# EAGLE design H_bridge (EAGLE 6.5.0)
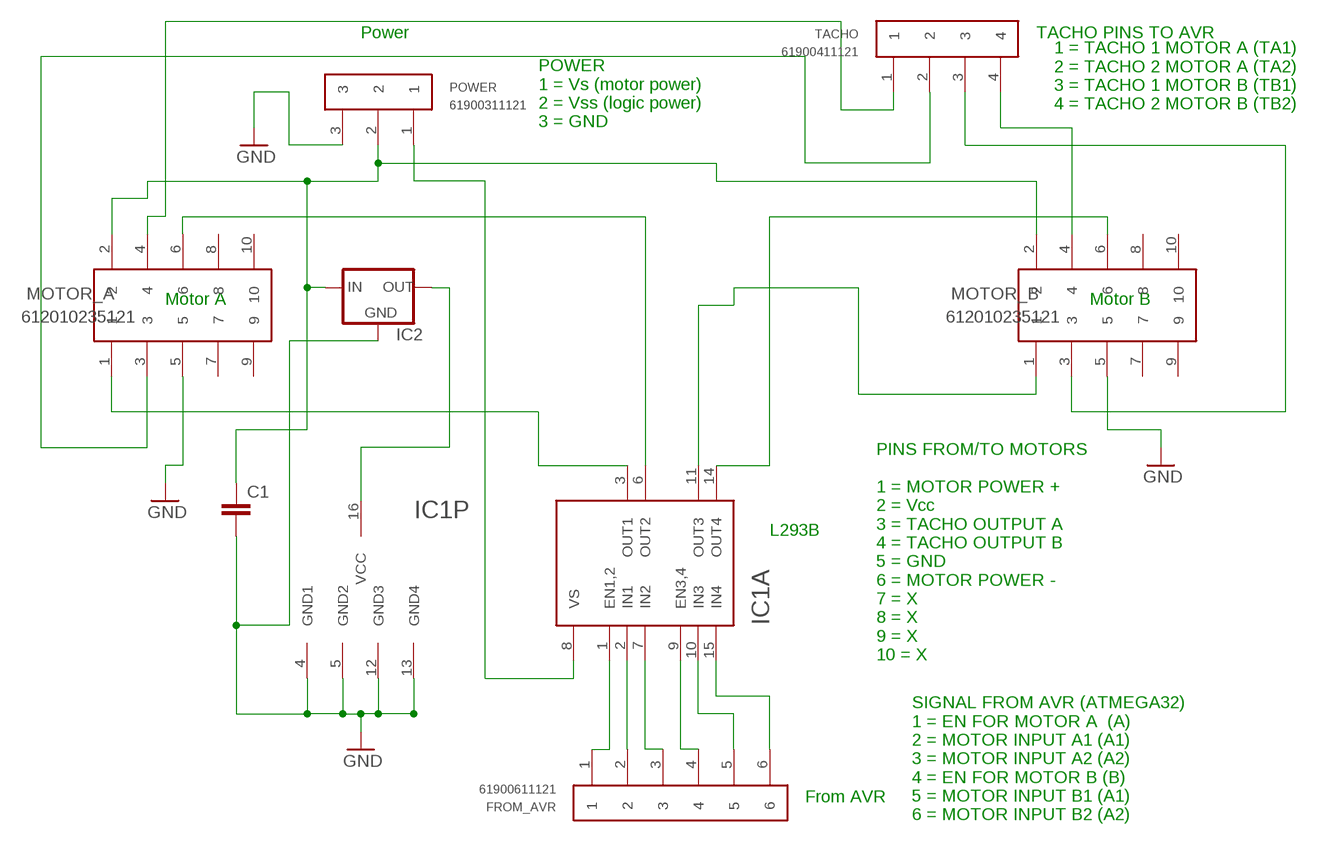
[diagram p0: schematic, sheet 1]

## Parts
C1  C7.5/5  [C7.5B5]
FROM_AVR  61900611121  [61900611121]
IC1  L293D  [DIP16]
IC2  V_REG_78XX-TO-220  [TO-220-ALT]
MOTOR_A  612010235121  [612010235121]
MOTOR_B  612010235121  [612010235121]
POWER  61900311121  [61900311121]
TACHO  61900411121  [61900411121]

## Nets
GND: C1.2 IC1.4(P:GND1) IC1.5(P:GND2) IC1.12(P:GND3) IC1.13(P:GND4) IC2.GND MOTOR_A.5 MOTOR_B.5 POWER.3
N$1: IC1.3(A:OUT1) MOTOR_A.1
N$2: IC1.6(A:OUT2) MOTOR_A.6
N$3: IC1.11(A:OUT3) MOTOR_B.1
N$4: IC1.14(A:OUT4) MOTOR_B.6
N$5: MOTOR_B.3 TACHO.3
N$6: IC1.16(P:VCC) IC2.OUT
N$7: C1.1 IC2.IN MOTOR_A.2 MOTOR_B.2 POWER.2
N$8: FROM_AVR.1 IC1.1(A:EN1,2)
N$9: FROM_AVR.2 IC1.2(A:IN1)
N$10: FROM_AVR.3 IC1.7(A:IN2)
N$11: FROM_AVR.4 IC1.9(A:EN3,4)
N$12: FROM_AVR.5 IC1.10(A:IN3)
N$13: FROM_AVR.6 IC1.15(A:IN4)
N$14: MOTOR_A.4 TACHO.1
N$15: MOTOR_A.3 TACHO.2
N$17: MOTOR_B.4 TACHO.4
N$18: IC1.8(A:VS) POWER.1
Unconnected: MOTOR_A.7 MOTOR_A.8 MOTOR_A.9 MOTOR_A.10 MOTOR_B.7 MOTOR_B.8 MOTOR_B.9 MOTOR_B.10

## Notes on the sheet
- Power | TACHO PINS TO AVR
- 1 = TACHO 1 MOTOR A (TA1)
  2 = TACHO 2 MOTOR A (TA2)
  3 = TACHO 1 MOTOR B (TB1)
  4 = TACHO 2 MOTOR B (TB2)
- POWER
  1 = Vs (motor power)
  2 = Vss (logic power)
  3 = GND
- Motor A | Motor B
- L293B
- PINS FROM/TO MOTORS
  
  1 = MOTOR POWER +
  2 = Vcc
  3 = TACHO OUTPUT A
  4 = TACHO OUTPUT B
  5 = GND
  6 = MOTOR POWER -
  7 = X
  8 = X
  9 = X
  10 = X
- From AVR
- SIGNAL FROM AVR (ATMEGA32)
  1 = EN FOR MOTOR A  (A)
  2 = MOTOR INPUT A1 (A1)
  3 = MOTOR INPUT A2 (A2)
  4 = EN FOR MOTOR B (B)
  5 = MOTOR INPUT B1 (A1)
  6 = MOTOR INPUT B2 (A2)

## Library data of the parts
C1 = capacitor-wima:C: CAPACITOR naming: grid - package width
FROM_AVR = Wuerth_Elektronik_eiCan_09_Wire_to_Board_Connectors:61900611121: WR-WTB 2.54mm Male Locking Header, 6 Pins
IC1 = ads:L293D: L293D Quad Half H-Bridge with integrated diodes
IC2 = SparkFun-PowerIC:V_REG_78XX: Voltage Regulator Standard 7805 5V regulator. IGO (Input Ground Output). Spark Fun Electronics SKU : COM-00107
MOTOR_A MOTOR_B = Wuerth_Elektronik_eiCan_05_Box_Header_IDC_Connectors_1_2:612010235121: WR-BHD 2.54mm Male Box Header High Temperature, 10 Pins
POWER = Wuerth_Elektronik_eiCan_09_Wire_to_Board_Connectors:61900311121: WR-WTB 2.54mm Male Locking Header, 3 Pins
TACHO = Wuerth_Elektronik_eiCan_09_Wire_to_Board_Connectors:61900411121: WR-WTB 2.54mm Male Locking Header, 4 Pins

## Net classes
0 default: clearance 0.205 mm

## Board
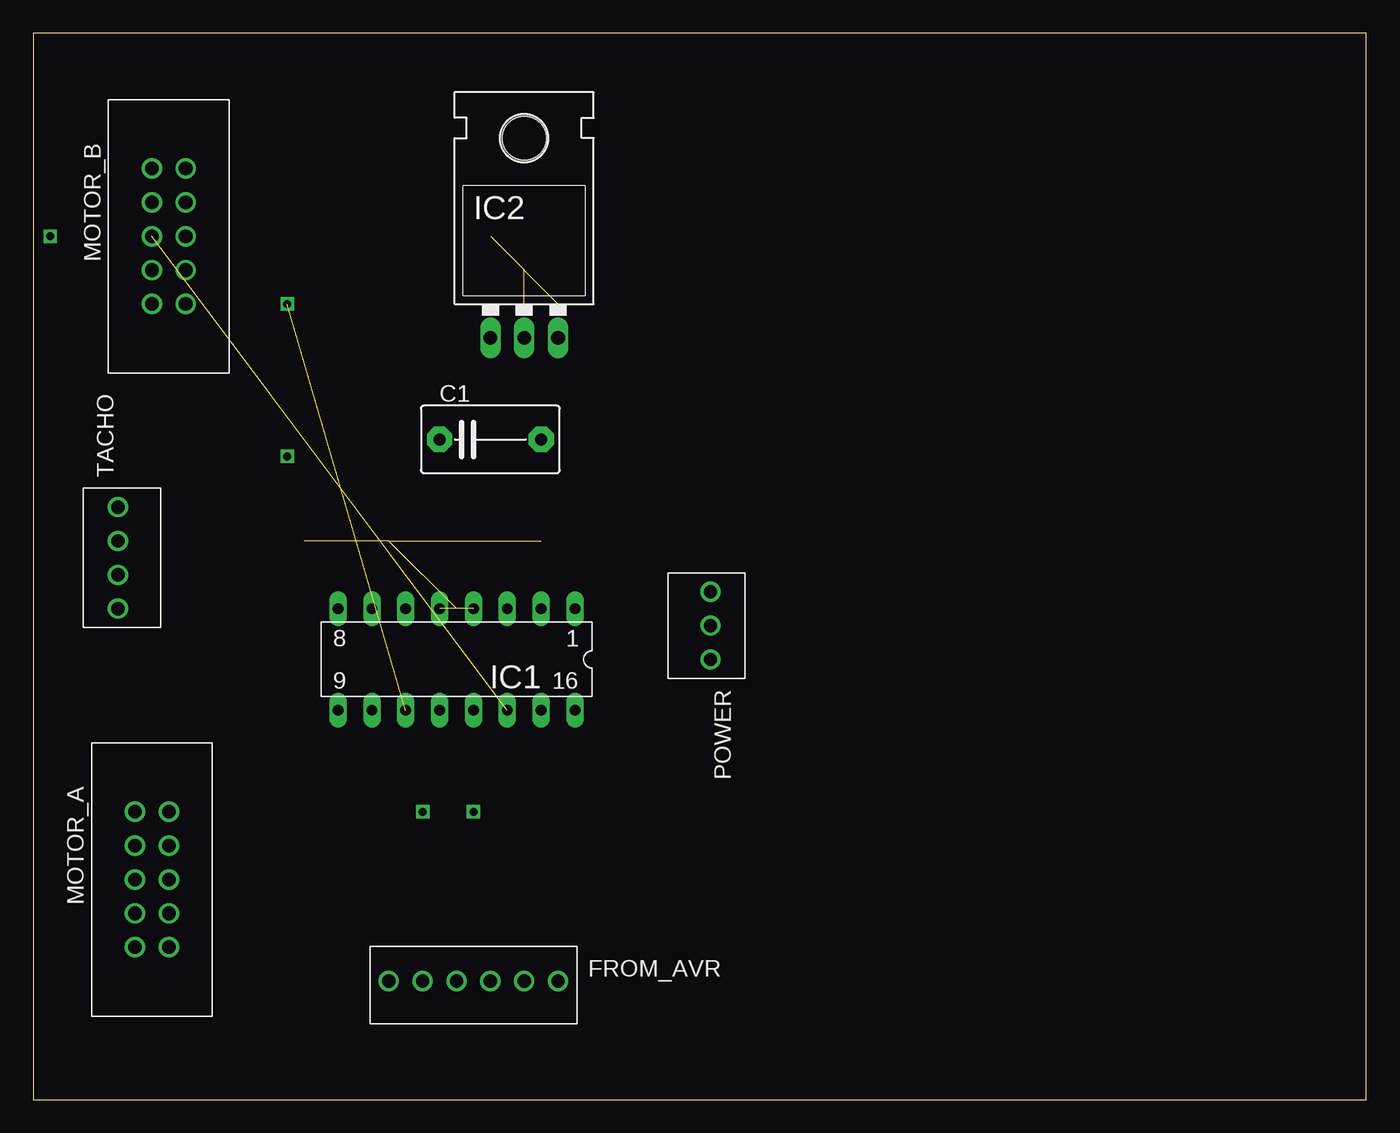
[diagram p1: board, top side]
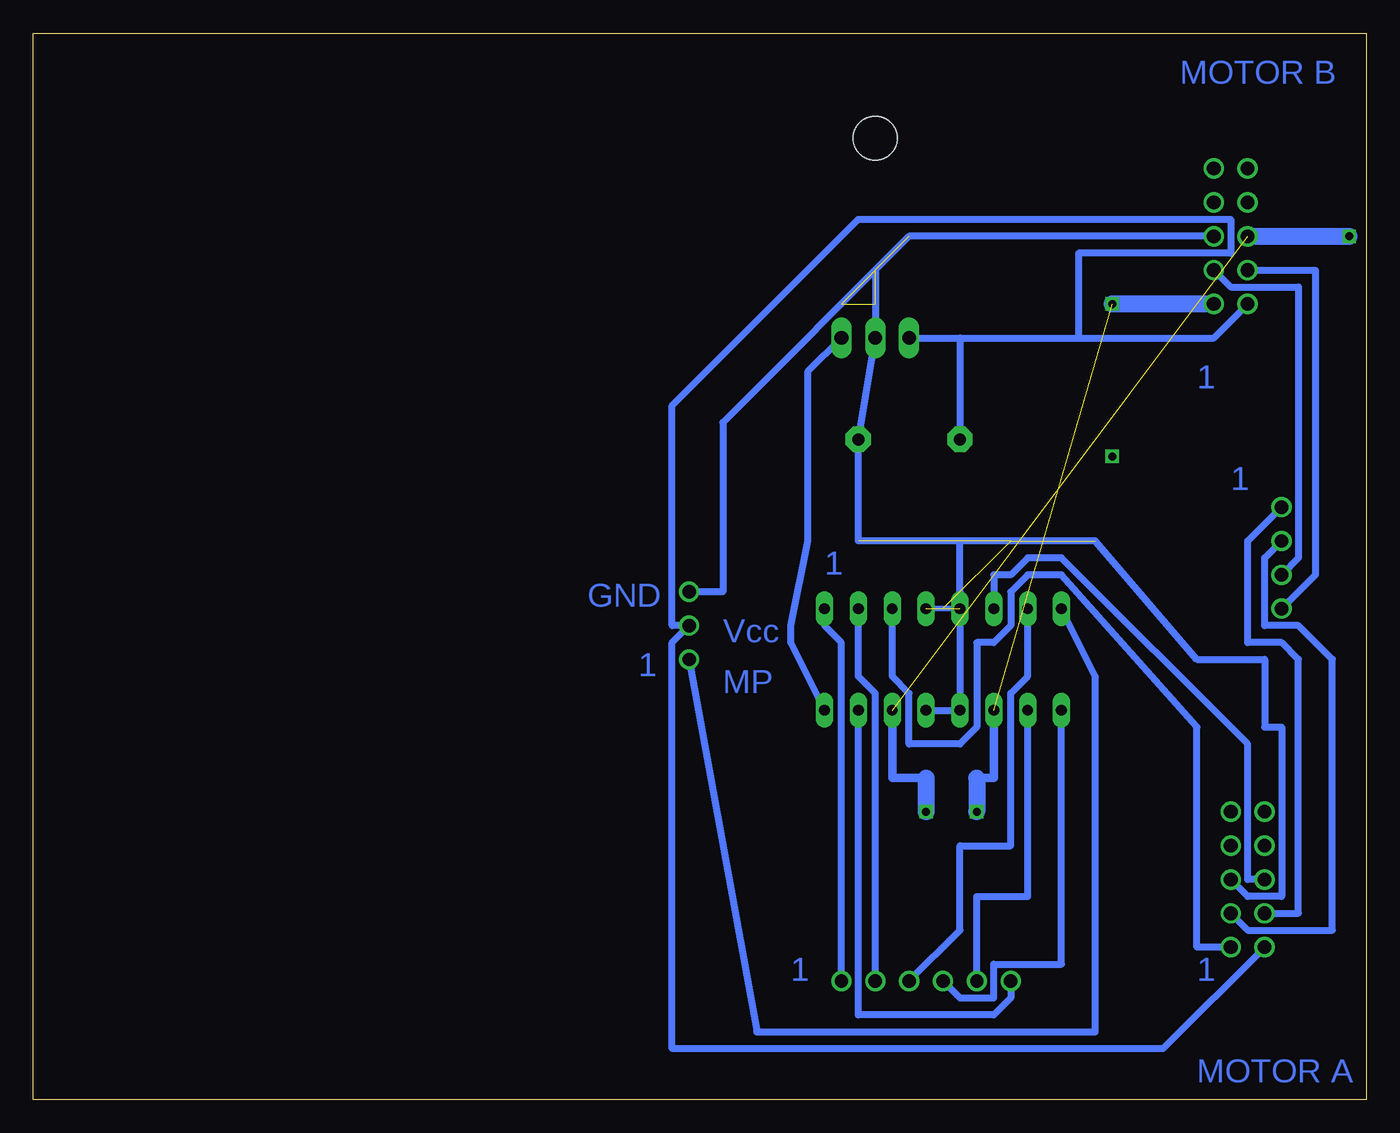
[diagram p2: board, bottom side, seen from below]

Size 100 x 80 mm. Coordinates in mm from the lower left corner, seen from the top.
Outline: 0,0 100,0 100,80 0,80 0,0
Copper layers (1*16): Top 0.035mm / dielectric 1.5mm / Bottom 0.035mm
Design rules "default *": minimum track width 20mil, minimum drill 24mil, track to track 8mil, track to pad 8mil, pad to pad 8mil, via to via 8mil, smd to smd 8mil, copper to edge 40mil, drill to drill 8mil, minimum pad ring 10mil, minimum via ring 8mil, stop-mask expansion 6mil, vias tented up to drill 0mil, thermal gap 10mil

### Footprints (pad centres in the part's own frame; a part is rotated, then mirrored left to right if it is on the bottom)
C7.5B5 = drill 0.914 pad 1.905 octagon: 1 -3.81,0; 2 3.81,0
61900611121 = drill 1: 1 1.27,0; 2 -1.27,0; 3 -3.81,0; 4 -6.35,0; 5 -8.89,0; 6 -11.43,0
DIP16 = drill 0.813 long: 1 -8.89,-3.81; 2 -6.35,-3.81; 3 -3.81,-3.81; 4 -1.27,-3.81; 5 1.27,-3.81; 6 3.81,-3.81; 7 6.35,-3.81; 8 8.89,-3.81; 9 8.89,3.81; 10 6.35,3.81; 11 3.81,3.81; 12 1.27,3.81; 13 -1.27,3.81; 14 -3.81,3.81; 15 -6.35,3.81; 16 -8.89,3.81
TO-220-ALT = drill 1.016 long: GND 0,-3.81; IN -2.54,-3.81; OUT 2.54,-3.81 | hole 3.302: 0,11.176
612010235121 = drill 1.02: 1 -2.54,-1.27; 2 -2.54,1.27; 3 0,-1.27; 4 0,1.27; 5 2.54,-1.27; 6 2.54,1.27; 7 5.08,-1.27; 8 5.08,1.27; 9 7.62,-1.27; 10 7.62,1.27
61900311121 = drill 1: 1 1.27,0; 2 -1.27,0; 3 -3.81,0
61900411121 = drill 1: 1 1.27,0; 2 -1.27,0; 3 -3.81,0; 4 -6.35,0

### Placement (x,y rotation side)
C1  34.29,49.53 0 top
FROM_AVR  38.1,8.89 0 top
IC1  31.75,33.02 180 top
IC2  36.83,60.96 0 top
MOTOR_A  8.89,13.97 90 top
MOTOR_B  10.16,62.23 90 top
POWER  50.8,34.29 270 top
TACHO  6.35,43.18 90 top

### Tracks (layer width: path | path; a pad name or v marks a point on that pad's centre or on a via)
GND  (8 unrouted)
  Bottom 0.406: IC1.5 IC1.4
  Bottom 0.508: IC1.13 IC1.12 IC1.5 | 30.48,38.1 IC1.5 | MOTOR_A.5 8.89,15.24 6.35,15.24 6.35,27.94 7.62,27.94 7.62,33.02 12.7,33.02 20.32,41.91 30.48,41.91 | POWER.3 48.26,38.1 48.26,50.8 34.29,64.77 MOTOR_B.5 | 36.83,62.23 IC2.GND C1.2 38.1,41.91 30.48,41.91 | IC1.5 30.48,41.91
N$1
  Bottom 0.508: IC1.3 35.56,31.75 34.29,30.48 34.29,26.67 30.48,26.67 29.21,27.94 29.21,34.29 27.94,34.29 26.67,35.56 26.67,38.1 25.4,39.37 22.86,39.37 12.7,27.94 12.7,11.43 MOTOR_A.1
N$2
  Bottom 0.508: IC1.6 27.94,39.37 26.67,39.37 25.4,40.64 22.86,40.64 8.89,26.67 8.89,16.51 MOTOR_A.6
N$3  (via drill 0.6)  (1 unrouted)
  Bottom 0.635: IC1.11 27.94,24.13 29.21,24.13
  Bottom 1.27: 29.21,24.13 v29.21,21.59 | MOTOR_B.1 v19.05,59.69
N$4  (via drill 0.6)  (1 unrouted)
  Bottom 0.635: IC1.14 35.56,24.13 33.02,24.13
  Bottom 1.27: 33.02,24.13 v33.02,21.59 | MOTOR_B.6 v1.27,64.77
N$5
  Bottom 0.508: TACHO.3 5.08,40.64 5.08,60.96 10.16,60.96 MOTOR_B.3
N$6
  Bottom 0.508: IC1.16 43.18,34.29 43.18,35.56 41.91,41.91 41.91,54.61 IC2.OUT
N$7
  Bottom 0.508: MOTOR_B.2 11.43,57.15 21.59,57.15 | IC2.IN 30.48,57.15 | 30.48,57.15 21.59,57.15 | MOTOR_A.2 15.24,3.81 52.07,3.81 52.07,34.29 POWER.2 52.07,35.56 52.07,52.07 38.1,66.04 10.16,66.04 10.16,63.5 21.59,63.5 21.59,57.15 | 30.48,57.15 C1.1
N$8
  Bottom 0.508: IC1.1 40.64,35.56 39.37,34.29 FROM_AVR.1
N$9
  Bottom 0.508: IC1.2 38.1,31.75 36.83,30.48 FROM_AVR.2
N$10
  Bottom 0.508: IC1.7 25.4,31.75 26.67,30.48 26.67,19.05 30.48,19.05 30.48,12.7 FROM_AVR.3
N$11
  Bottom 0.508: IC1.9 22.86,10.16 27.94,10.16 27.94,7.62 30.48,7.62 FROM_AVR.4
N$12
  Bottom 0.508: IC1.10 25.4,15.24 29.21,15.24 FROM_AVR.5
N$13
  Bottom 0.508: IC1.15 38.1,6.35 27.94,6.35 26.67,7.62 FROM_AVR.6
N$14
  Bottom 0.508: TACHO.1 8.89,41.91 8.89,34.29 6.35,34.29 5.08,33.02 5.08,13.97 MOTOR_A.4
N$15
  Bottom 0.508: TACHO.2 7.62,40.64 7.62,35.56 5.08,35.56 2.54,33.02 2.54,12.7 8.89,12.7 MOTOR_A.3
N$16  (via drill 0.6)
  other vias: 19.05,48.26
N$17
  Bottom 0.508: TACHO.4 3.81,39.37 3.81,62.23 MOTOR_B.4
N$18
  Bottom 0.508: IC1.8 20.32,31.75 20.32,5.08 45.72,5.08 POWER.1

### Text on the board
Bottom: MOTOR B | 1 | 1 | 1 | Vcc | GND | 1 | MP | 1 | 1 | MOTOR A